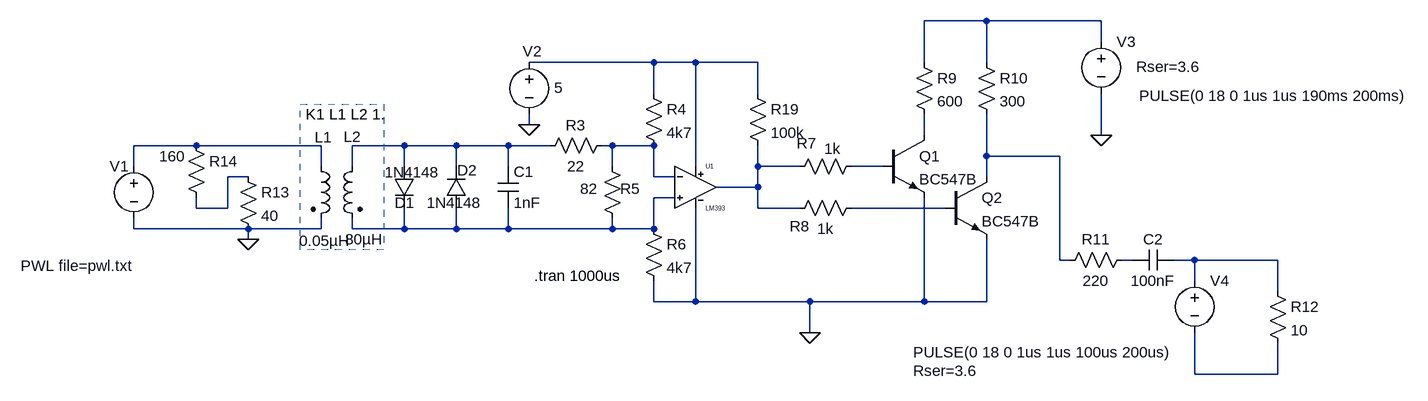
[diagram p0: schematic mfx-link.asc]
mfx-link.asc, the LTspice schematic file:
Version 4
SHEET 1 1776 680
WIRE 1024 -80 928 -80
WIRE 1200 -80 1024 -80
WIRE 1200 -48 1200 -80
WIRE 512 -16 320 -16
WIRE 576 -16 512 -16
WIRE 672 -16 576 -16
WIRE 928 -16 928 -80
WIRE 1024 -16 1024 -80
WIRE 512 32 512 -16
WIRE 672 32 672 -16
WIRE 320 80 320 64
WIRE 928 96 928 64
WIRE 1200 96 1200 32
WIRE -192 112 -288 112
WIRE -48 112 -192 112
WIRE 0 112 -48 112
WIRE 128 112 48 112
WIRE 208 112 128 112
WIRE 288 112 208 112
WIRE 352 112 288 112
WIRE 448 112 432 112
WIRE 512 112 448 112
WIRE 1024 128 1024 64
WIRE 1136 128 1024 128
WIRE -288 144 -288 112
WIRE 0 144 0 112
WIRE 48 144 48 112
WIRE 128 144 128 112
WIRE 208 144 208 112
WIRE 288 144 288 112
WIRE 448 144 448 112
WIRE 576 144 576 -16
WIRE 672 144 672 112
WIRE 736 144 672 144
WIRE 864 144 816 144
WIRE -112 160 -144 160
WIRE 512 160 512 112
WIRE 544 160 512 160
WIRE 1024 160 1024 128
WIRE 672 176 672 144
WIRE 672 176 608 176
WIRE 544 192 512 192
WIRE -192 208 -192 192
WIRE -144 208 -144 160
WIRE -144 208 -192 208
WIRE 672 208 672 176
WIRE 736 208 672 208
WIRE 960 208 816 208
WIRE -288 240 -288 224
WIRE -112 240 -288 240
WIRE 0 240 0 224
WIRE 0 240 -112 240
WIRE 48 240 48 224
WIRE 128 240 128 208
WIRE 128 240 48 240
WIRE 208 240 208 208
WIRE 208 240 128 240
WIRE 288 240 288 208
WIRE 288 240 208 240
WIRE 448 240 448 224
WIRE 448 240 288 240
WIRE 512 240 512 192
WIRE 512 240 448 240
WIRE -112 256 -112 240
WIRE 1136 288 1136 128
WIRE 1152 288 1136 288
WIRE 1248 288 1232 288
WIRE 1344 288 1312 288
WIRE 1472 288 1344 288
WIRE 1344 320 1344 288
WIRE 1472 336 1472 288
WIRE 512 352 512 320
WIRE 576 352 576 208
WIRE 576 352 512 352
WIRE 752 352 576 352
WIRE 928 352 928 192
WIRE 928 352 752 352
WIRE 1024 352 1024 256
WIRE 1024 352 928 352
WIRE 752 400 752 352
WIRE 1344 464 1344 400
WIRE 1472 464 1472 416
WIRE 1472 464 1344 464
FLAG 752 400 0
FLAG 320 80 0
FLAG 1200 96 0
FLAG -112 256 0
DATAFLAG -48 112 ""
SYMBOL diode 112 144 R0
WINDOW 0 1 56 Left 2
WINDOW 3 -14 9 Left 2
SYMATTR InstName D1
SYMATTR Value 1N4148
SYMBOL diode 224 208 R180
WINDOW 0 -16 58 Left 2
WINDOW 3 -23 8 Left 2
SYMATTR InstName D2
SYMATTR Value 1N4148
SYMBOL cap 272 144 R0
SYMATTR InstName C1
SYMATTR Value 1nF
SYMBOL res 448 96 R90
WINDOW 0 0 56 VBottom 2
WINDOW 3 32 56 VTop 2
SYMATTR InstName R3
SYMATTR Value 22
SYMBOL res 464 240 R180
WINDOW 0 -27 62 Left 2
WINDOW 3 38 62 Left 2
SYMATTR InstName R5
SYMATTR Value 82
SYMBOL voltage -288 128 R0
WINDOW 3 -174 169 Left 2
WINDOW 123 0 0 Left 2
WINDOW 39 -174 197 Left 2
WINDOW 0 -37 16 Left 2
SYMATTR Value PWL file=pwl.txt
SYMATTR InstName V1
SYMBOL res 496 16 R0
SYMATTR InstName R4
SYMATTR Value 4k7
SYMBOL res 496 224 R0
SYMATTR InstName R6
SYMATTR Value 4k7
SYMBOL res 656 16 R0
SYMATTR InstName R19
SYMATTR Value 100k
SYMBOL res 832 128 R90
WINDOW 0 -4 85 VBottom 2
WINDOW 3 -27 45 VTop 2
SYMATTR InstName R7
SYMATTR Value 1k
SYMBOL res 832 192 R90
WINDOW 0 60 96 VBottom 2
WINDOW 3 32 56 VTop 2
SYMATTR InstName R8
SYMATTR Value 1k
SYMBOL npn 864 96 R0
SYMATTR InstName Q1
SYMATTR Value BC547B
SYMBOL npn 960 160 R0
SYMATTR InstName Q2
SYMATTR Value BC547B
SYMBOL voltage 320 -32 R0
WINDOW 123 0 0 Left 2
WINDOW 39 0 0 Left 2
WINDOW 0 -10 -1 Left 2
WINDOW 3 39 55 Left 2
SYMATTR InstName V2
SYMATTR Value 5
SYMBOL voltage 1200 -64 R0
WINDOW 3 59 99 Left 2
WINDOW 123 0 0 Left 2
WINDOW 39 54 55 Left 2
SYMATTR Value PULSE(0 18 0 1us 1us 190ms 200ms)
SYMATTR SpiceLine Rser=3.6
SYMATTR InstName V3
SYMBOL res 912 -32 R0
SYMATTR InstName R9
SYMATTR Value 600
SYMBOL res 1008 -32 R0
SYMATTR InstName R10
SYMATTR Value 300
SYMBOL voltage 1344 304 R0
WINDOW 3 -433 126 Left 2
WINDOW 123 0 0 Left 2
WINDOW 39 -433 154 Left 2
SYMATTR Value PULSE(0 18 0 1us 1us 100us 200us)
SYMATTR SpiceLine Rser=3.6
SYMATTR InstName V4
SYMBOL res 1248 272 R90
WINDOW 0 0 56 VBottom 2
WINDOW 3 32 56 VTop 2
SYMATTR InstName R11
SYMATTR Value 220
SYMBOL cap 1312 272 R90
WINDOW 0 0 32 VBottom 2
WINDOW 3 32 32 VTop 2
SYMATTR InstName C2
SYMATTR Value 100nF
SYMBOL res 1456 320 R0
SYMATTR InstName R12
SYMATTR Value 10
SYMBOL ind2 -16 128 R0
WINDOW 0 6 -29 Left 2
WINDOW 3 -18 130 Left 2
SYMATTR InstName L1
SYMATTR Value 0.05µH
SYMATTR Type ind
SYMATTR SpiceLine Rser=0.1
SYMBOL ind2 64 128 M0
WINDOW 0 2 -30 Left 2
WINDOW 3 -31 128 Left 2
SYMATTR InstName L2
SYMATTR Value 80µH
SYMATTR Type ind
SYMATTR SpiceLine Rser=1.14 Rpar=1.14
SYMBOL res -208 96 R0
WINDOW 3 -41 32 Left 2
SYMATTR Value 160
SYMATTR InstName R14
SYMBOL res -128 144 R0
SYMATTR InstName R13
SYMATTR Value 40
SYMBOL Comparators\\LM393 576 112 R0
SYMATTR InstName U1
TEXT 328 312 Left 2 !.tran 1000us
TEXT -24 64 Left 2 !K1 L1 L2 1.
RECTANGLE Normal 96 272 -32 48 2

The netlist it stands for:
* mfx-link.asc
D1 N005 N011 1N4148
D2 N011 N005 1N4148
C1 N005 N011 1nF
R3 N006 N005 22
R5 N011 N006 82
V1 N004 0 PWL file=pwl.txt
R4 N002 N006 4k7
R6 N011 0 4k7
R19 N002 N008 100k
R7 N009 N008 1k
R8 N012 N008 1k
Q1 N003 N009 0 0 BC547B
Q2 N007 N012 0 0 BC547B
V2 N002 0 5
V3 N001 0 PULSE(0 18 0 1us 1us 190ms 200ms) Rser=3.6
R9 N001 N003 600
R10 N001 N007 300
V4 N014 N015 PULSE(0 18 0 1us 1us 100us 200us) Rser=3.6
R11 N013 N007 220
C2 N014 N013 100nF
R12 N014 N015 10
L1 N004 0 0.05µH Rser=0.1
L2 N005 N011 80µH Rser=1.14 Rpar=1.14
R14 N004 N010 160
R13 N010 0 40
XU1 N011 N006 N002 0 N008 LM393  ; pins In+ In- V+ V- OUT
.model D D
.lib standard.dio
.model NPN NPN
.model PNP PNP
.lib standard.bjt
.tran 1000us
K1 L1 L2 1.
.lib LM393.sub
.backanno
.end